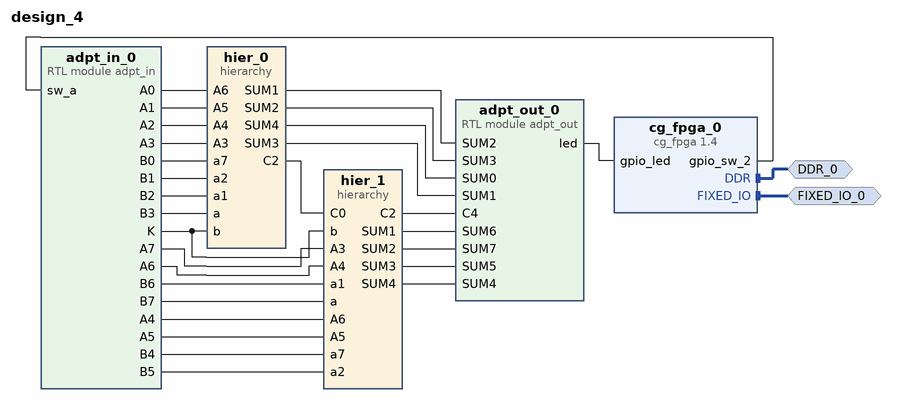
[diagram p0: block diagram of the top level]
# Vivado block design design_4, xc7z020clg400-1, Vivado 2024.2
create_bd_design design_4

create_bd_intf_port -mode Master -vlnv xilinx.com:display_processing_system7:fixedio_rtl:1.0 FIXED_IO_0
create_bd_intf_port -mode Master -vlnv xilinx.com:interface:ddrx_rtl:1.0 DDR_0

create_bd_cell -type ip -vlnv educg.net:user:cg_fpga:1.4 cg_fpga_0
create_bd_cell -type module -reference adpt_in adpt_in_0
create_bd_cell -type module -reference adpt_out adpt_out_0
create_bd_cell -type hier hier_0
create_bd_cell -type hier hier_1

# ---- hierarchy /hier_0 ----
current_bd_instance /hier_0
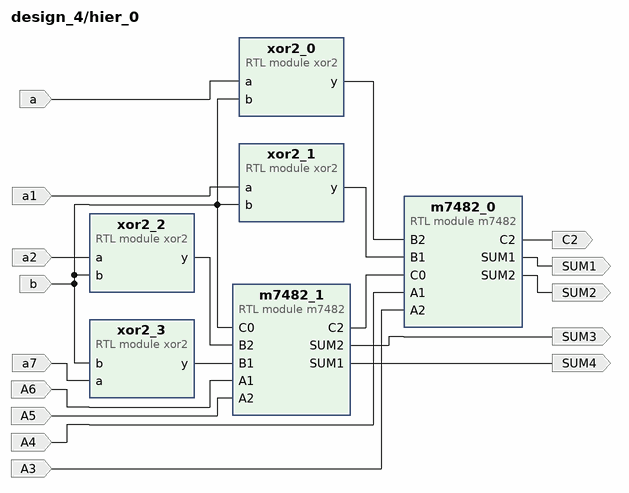
[diagram p1: block diagram inside /hier_0]
create_bd_pin -dir I a
create_bd_pin -dir I b
create_bd_pin -dir I a1
create_bd_pin -dir I a2
create_bd_pin -dir I A3
create_bd_pin -dir I A4
create_bd_pin -dir O SUM2
create_bd_pin -dir O SUM1
create_bd_pin -dir O C2
create_bd_pin -dir I A5
create_bd_pin -dir I A6
create_bd_pin -dir O SUM3
create_bd_pin -dir O SUM4
create_bd_pin -dir I a7

create_bd_cell -type module -reference xor2 xor2_0
create_bd_cell -type module -reference xor2 xor2_1
create_bd_cell -type module -reference xor2 xor2_2
create_bd_cell -type module -reference m7482 m7482_0
create_bd_cell -type module -reference m7482 m7482_1
create_bd_cell -type module -reference xor2 xor2_3

# ---- hierarchy /hier_1 ----
current_bd_instance /hier_1
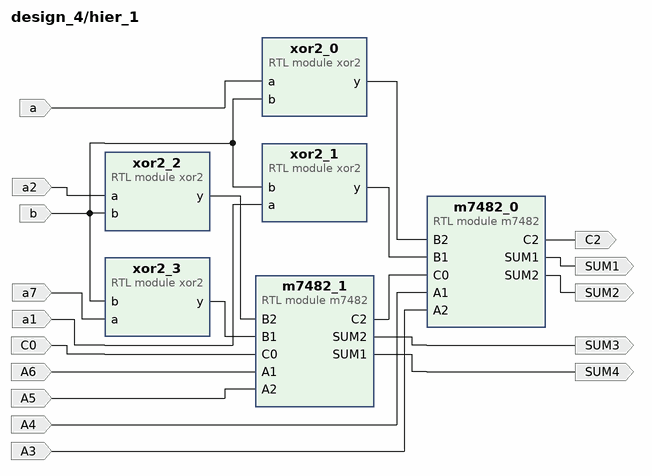
[diagram p2: block diagram inside /hier_1]
create_bd_pin -dir I a
create_bd_pin -dir I b
create_bd_pin -dir I a1
create_bd_pin -dir I a2
create_bd_pin -dir I A3
create_bd_pin -dir I A4
create_bd_pin -dir O SUM2
create_bd_pin -dir O SUM1
create_bd_pin -dir O C2
create_bd_pin -dir I A5
create_bd_pin -dir I A6
create_bd_pin -dir O SUM3
create_bd_pin -dir O SUM4
create_bd_pin -dir I a7
create_bd_pin -dir I C0

create_bd_cell -type module -reference xor2 xor2_0
create_bd_cell -type module -reference xor2 xor2_1
create_bd_cell -type module -reference xor2 xor2_2
create_bd_cell -type module -reference m7482 m7482_0
create_bd_cell -type module -reference m7482 m7482_1
create_bd_cell -type module -reference xor2 xor2_3

# ---- connections ----

current_bd_instance /hier_0
connect_bd_net -net adpt_in_0_A0 [get_bd_pins A6] [get_bd_pins m7482_1/A1]
connect_bd_net -net adpt_in_0_A1 [get_bd_pins A5] [get_bd_pins m7482_1/A2]
connect_bd_net -net adpt_in_0_A2 [get_bd_pins A4] [get_bd_pins m7482_0/A1]
connect_bd_net -net adpt_in_0_A3 [get_bd_pins A3] [get_bd_pins m7482_0/A2]
connect_bd_net -net adpt_in_0_B0 [get_bd_pins a7] [get_bd_pins xor2_3/a]
connect_bd_net -net adpt_in_0_B1 [get_bd_pins a2] [get_bd_pins xor2_2/a]
connect_bd_net -net adpt_in_0_B2 [get_bd_pins a1] [get_bd_pins xor2_1/a]
connect_bd_net -net adpt_in_0_B3 [get_bd_pins a] [get_bd_pins xor2_0/a]
connect_bd_net -net adpt_in_0_K [get_bd_pins b] \
  [get_bd_pins m7482_1/C0] [get_bd_pins xor2_0/b] [get_bd_pins xor2_1/b] [get_bd_pins xor2_2/b] [get_bd_pins xor2_3/b]
connect_bd_net [get_bd_pins m7482_0/C2] [get_bd_pins C2]
connect_bd_net [get_bd_pins m7482_0/SUM1] [get_bd_pins SUM1]
connect_bd_net [get_bd_pins m7482_0/SUM2] [get_bd_pins SUM2]
connect_bd_net [get_bd_pins m7482_1/C2] [get_bd_pins m7482_0/C0]
connect_bd_net [get_bd_pins m7482_1/SUM1] [get_bd_pins SUM4]
connect_bd_net [get_bd_pins m7482_1/SUM2] [get_bd_pins SUM3]
connect_bd_net [get_bd_pins xor2_0/y] [get_bd_pins m7482_0/B2]
connect_bd_net [get_bd_pins xor2_1/y] [get_bd_pins m7482_0/B1]
connect_bd_net [get_bd_pins xor2_2/y] [get_bd_pins m7482_1/B2]
connect_bd_net [get_bd_pins xor2_3/y] [get_bd_pins m7482_1/B1]

current_bd_instance /hier_1
connect_bd_net -net C0_1 [get_bd_pins C0] [get_bd_pins m7482_1/C0]
connect_bd_net -net adpt_in_0_A0 [get_bd_pins A6] [get_bd_pins m7482_1/A1]
connect_bd_net -net adpt_in_0_A1 [get_bd_pins A5] [get_bd_pins m7482_1/A2]
connect_bd_net -net adpt_in_0_A2 [get_bd_pins A4] [get_bd_pins m7482_0/A1]
connect_bd_net -net adpt_in_0_A3 [get_bd_pins A3] [get_bd_pins m7482_0/A2]
connect_bd_net -net adpt_in_0_B0 [get_bd_pins a7] [get_bd_pins xor2_3/a]
connect_bd_net -net adpt_in_0_B1 [get_bd_pins a2] [get_bd_pins xor2_2/a]
connect_bd_net -net adpt_in_0_B2 [get_bd_pins a1] [get_bd_pins xor2_1/a]
connect_bd_net -net adpt_in_0_B3 [get_bd_pins a] [get_bd_pins xor2_0/a]
connect_bd_net [get_bd_pins b] [get_bd_pins xor2_2/b] [get_bd_pins xor2_1/b] [get_bd_pins xor2_3/b] [get_bd_pins xor2_0/b]
connect_bd_net [get_bd_pins m7482_0/C2] [get_bd_pins C2]
connect_bd_net [get_bd_pins m7482_0/SUM1] [get_bd_pins SUM1]
connect_bd_net [get_bd_pins m7482_0/SUM2] [get_bd_pins SUM2]
connect_bd_net [get_bd_pins m7482_1/C2] [get_bd_pins m7482_0/C0]
connect_bd_net [get_bd_pins m7482_1/SUM1] [get_bd_pins SUM4]
connect_bd_net [get_bd_pins m7482_1/SUM2] [get_bd_pins SUM3]
connect_bd_net [get_bd_pins xor2_0/y] [get_bd_pins m7482_0/B2]
connect_bd_net [get_bd_pins xor2_1/y] [get_bd_pins m7482_0/B1]
connect_bd_net [get_bd_pins xor2_2/y] [get_bd_pins m7482_1/B2]
connect_bd_net [get_bd_pins xor2_3/y] [get_bd_pins m7482_1/B1]

current_bd_instance /
connect_bd_intf_net [get_bd_intf_ports DDR_0] [get_bd_intf_pins cg_fpga_0/DDR]
connect_bd_intf_net [get_bd_intf_ports FIXED_IO_0] [get_bd_intf_pins cg_fpga_0/FIXED_IO]
connect_bd_net -net A3_1 [get_bd_pins adpt_in_0/A7] [get_bd_pins hier_1/A3]
connect_bd_net -net A4_1 [get_bd_pins adpt_in_0/A6] [get_bd_pins hier_1/A4]
connect_bd_net -net a1_1 [get_bd_pins adpt_in_0/B6] [get_bd_pins hier_1/a1]
connect_bd_net -net a_1 [get_bd_pins adpt_in_0/B7] [get_bd_pins hier_1/a]
connect_bd_net [get_bd_pins adpt_in_0/A0] [get_bd_pins hier_0/A6]
connect_bd_net [get_bd_pins adpt_in_0/A1] [get_bd_pins hier_0/A5]
connect_bd_net [get_bd_pins adpt_in_0/A2] [get_bd_pins hier_0/A4]
connect_bd_net [get_bd_pins adpt_in_0/A3] [get_bd_pins hier_0/A3]
connect_bd_net [get_bd_pins adpt_in_0/A4] [get_bd_pins hier_1/A6]
connect_bd_net [get_bd_pins adpt_in_0/A5] [get_bd_pins hier_1/A5]
connect_bd_net [get_bd_pins adpt_in_0/B0] [get_bd_pins hier_0/a7]
connect_bd_net [get_bd_pins adpt_in_0/B1] [get_bd_pins hier_0/a2]
connect_bd_net [get_bd_pins adpt_in_0/B2] [get_bd_pins hier_0/a1]
connect_bd_net [get_bd_pins adpt_in_0/B3] [get_bd_pins hier_0/a]
connect_bd_net [get_bd_pins adpt_in_0/B4] [get_bd_pins hier_1/a7]
connect_bd_net [get_bd_pins adpt_in_0/B5] [get_bd_pins hier_1/a2]
connect_bd_net [get_bd_pins adpt_in_0/K] [get_bd_pins hier_0/b] [get_bd_pins hier_1/b]
connect_bd_net [get_bd_pins adpt_out_0/led] [get_bd_pins cg_fpga_0/gpio_led]
connect_bd_net [get_bd_pins cg_fpga_0/gpio_sw_2] [get_bd_pins adpt_in_0/sw_a]
connect_bd_net [get_bd_pins hier_0/C2] [get_bd_pins hier_1/C0]
connect_bd_net [get_bd_pins hier_1/C2] [get_bd_pins adpt_out_0/C4]
connect_bd_net [get_bd_pins hier_1/SUM1] [get_bd_pins adpt_out_0/SUM6]
connect_bd_net [get_bd_pins hier_1/SUM2] [get_bd_pins adpt_out_0/SUM7]
connect_bd_net [get_bd_pins hier_1/SUM3] [get_bd_pins adpt_out_0/SUM5]
connect_bd_net [get_bd_pins hier_1/SUM4] [get_bd_pins adpt_out_0/SUM4]
connect_bd_net -net m7482_0_SUM1 [get_bd_pins hier_0/SUM1] [get_bd_pins adpt_out_0/SUM2]
connect_bd_net -net m7482_0_SUM2 [get_bd_pins hier_0/SUM2] [get_bd_pins adpt_out_0/SUM3]
connect_bd_net -net m7482_1_SUM1 [get_bd_pins hier_0/SUM4] [get_bd_pins adpt_out_0/SUM0]
connect_bd_net -net m7482_1_SUM2 [get_bd_pins hier_0/SUM3] [get_bd_pins adpt_out_0/SUM1]

validate_bd_design
save_bd_design
